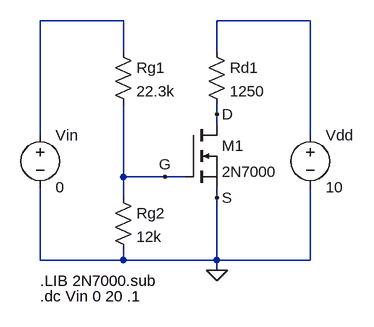
[diagram p0: schematic PL1.asc]
PL1.asc, the LTspice schematic file:
Version 4
SHEET 1 880 680
WIRE 208 -192 80 -192
WIRE 496 -192 352 -192
WIRE 208 -144 208 -192
WIRE 352 -144 352 -192
WIRE 352 -48 352 -64
WIRE 352 -32 352 -48
WIRE 80 -16 80 -192
WIRE 496 -16 496 -192
WIRE 208 48 208 -64
WIRE 272 48 208 48
WIRE 304 48 272 48
WIRE 208 80 208 48
WIRE 352 80 352 64
WIRE 80 176 80 64
WIRE 208 176 208 160
WIRE 208 176 80 176
WIRE 352 176 352 80
WIRE 352 176 208 176
WIRE 496 176 496 64
WIRE 496 176 352 176
WIRE 352 192 352 176
FLAG 352 -48 D
FLAG 352 80 S
FLAG 272 48 G
FLAG 352 192 0
SYMBOL res 192 64 R0
SYMATTR InstName Rg2
SYMATTR Value 12k
SYMBOL res 192 -160 R0
SYMATTR InstName Rg1
SYMATTR Value 22.3k
SYMBOL res 336 -160 R0
SYMATTR InstName Rd1
SYMATTR Value 1250
SYMBOL voltage 80 -32 R0
WINDOW 123 0 0 Left 0
WINDOW 39 0 0 Left 0
SYMATTR InstName Vin
SYMATTR Value 0
SYMBOL voltage 496 -32 R0
WINDOW 123 0 0 Left 0
WINDOW 39 0 0 Left 0
SYMATTR InstName Vdd
SYMATTR Value 10
SYMBOL nmos 304 -32 R0
SYMATTR InstName M1
SYMATTR Value 2N7000
TEXT 80 208 Left 2 !.LIB 2N7000.sub
TEXT 80 232 Left 2 !.dc Vin 0 20 .1

The netlist it stands for:
* PL1.asc
Rg2 G 0 12k
Rg1 N001 G 22.3k
Rd1 N002 D 1250
Vin N001 0 0
Vdd N002 0 10
M1 D G 0 0 2N7000
.model NMOS NMOS
.model PMOS PMOS
.lib standard.mos
.LIB 2N7000.sub
.dc Vin 0 20 .1
.backanno
.end

* Results of the author's LTspice run, read from the files saved beside the schematic
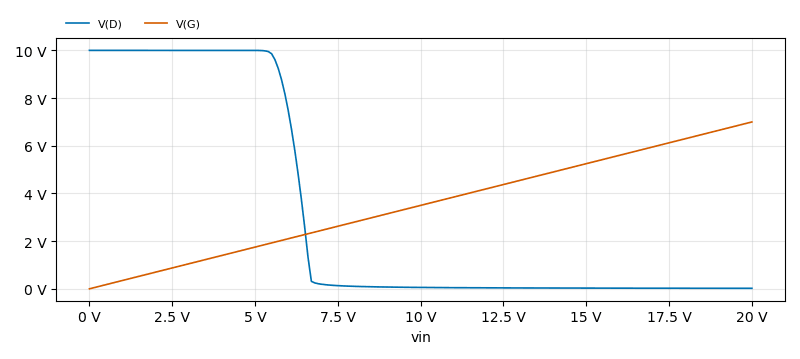
[diagram p1: DC transfer characteristic of PL1.asc, plotted from the saved traces]
* DC transfer characteristic, 1 run:
*   V(D): 10 V at vin=0 V, 20.01 mV at vin=20 V, min 20.01 mV, max 10 V
*   V(G): 0 V at vin=0 V, 6.997 V at vin=20 V, min 0 V, max 6.997 V